# EasyEDA Pro project ACDC_双向.eprj, board 全桥（TO-277）
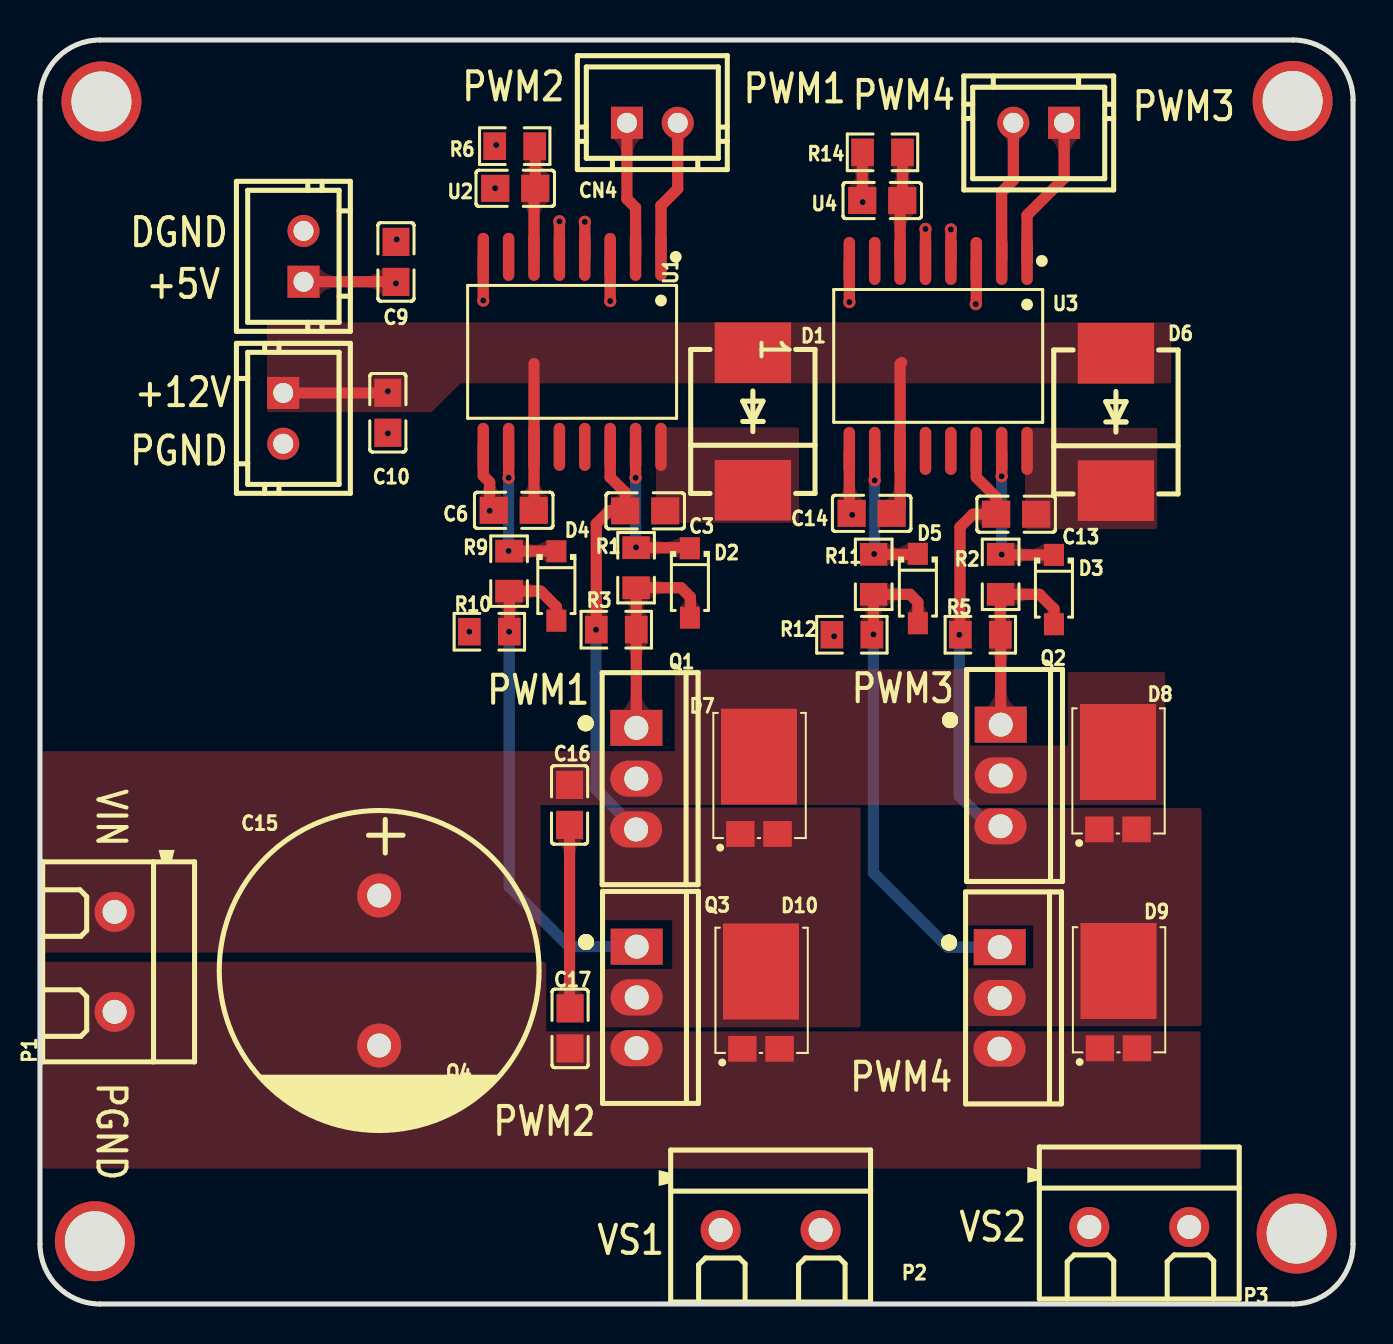
[diagram p9: board, top side]
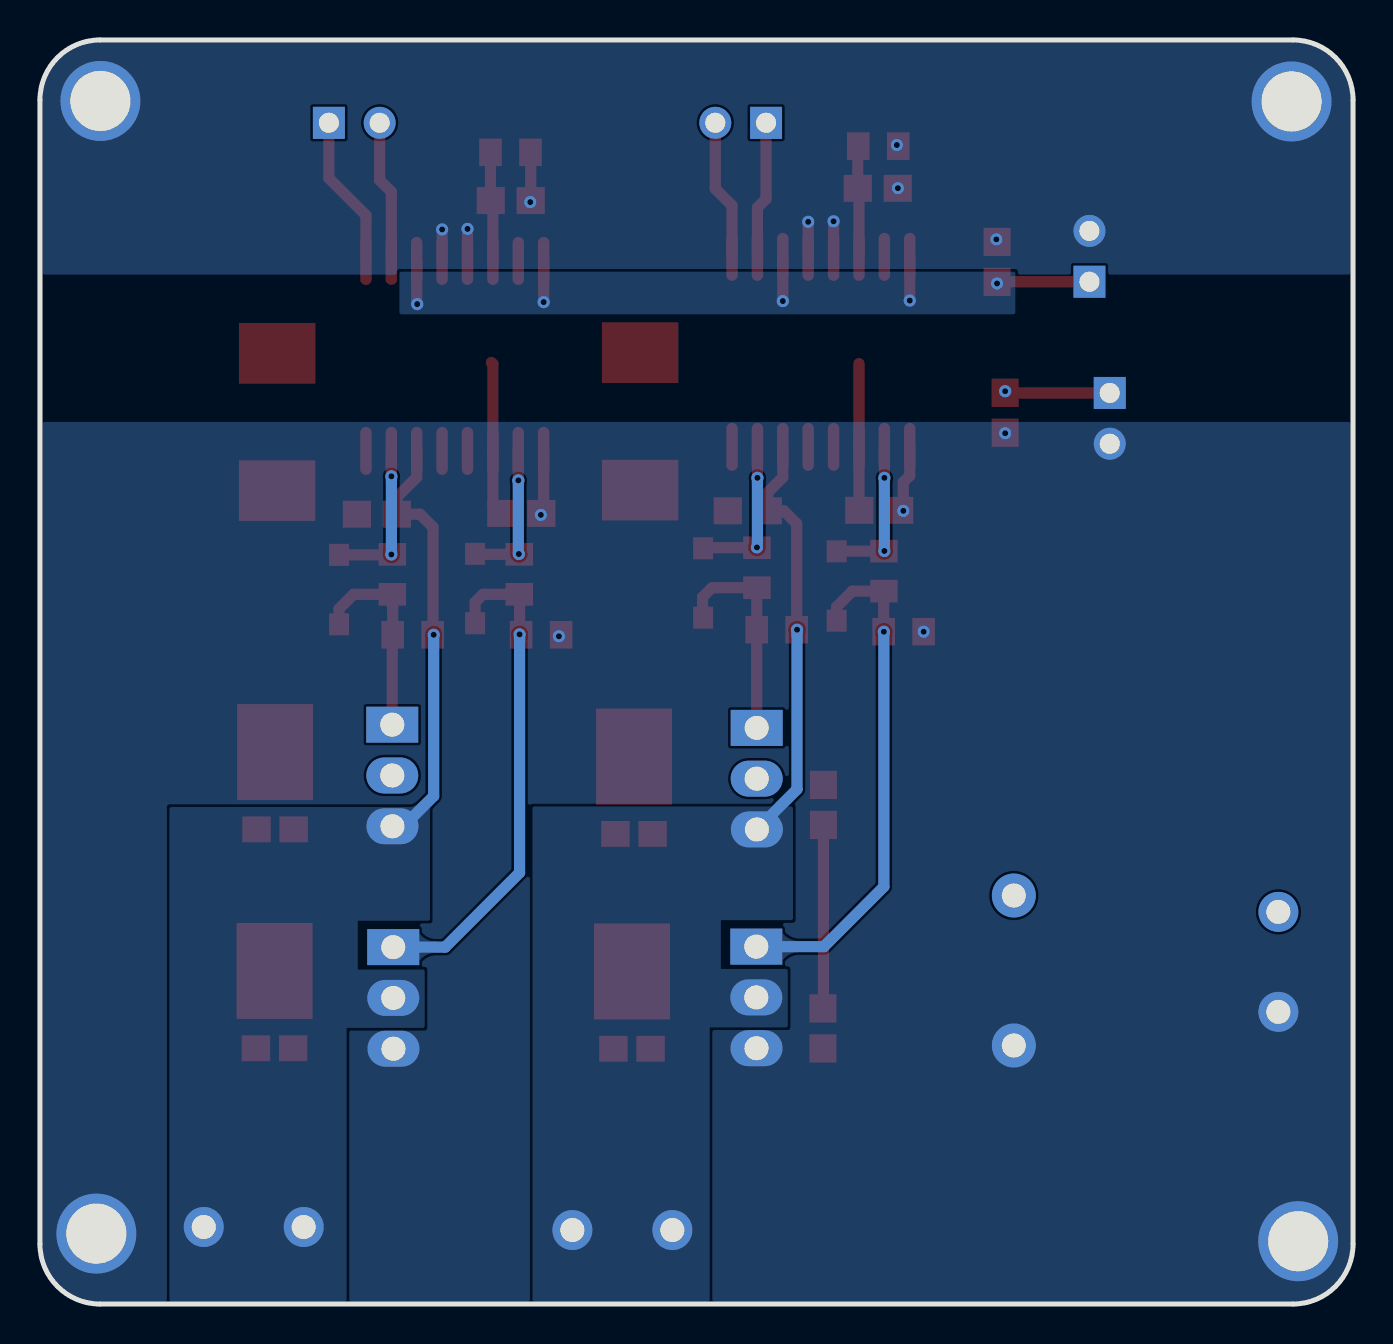
[diagram p10: board, bottom side, seen from below]

Outline 65.68 x 63.21 mm; copper layers: Top Layer, Bottom Layer. Coordinates in mm from the lower left corner of the outline.
Outline path: 0,60.21 0,3 arc(0.88,0.88) 3,0 62.68,0 arc(64.81,0.88) 65.68,3 65.68,60.21 arc(64.81,62.33) 62.68,63.21 3,63.21 arc(0.88,62.33) 0,60.21
Stack: Top Layer 0.035mm / Dielectric1 1.51mm FR4 er 4.5 / Bottom Layer 0.035mm

## Design rules (mm)
template: 自定义配置
spacing copperThickness1oz (default): track to track 0.102, other pairs 0.152 to 0.3
spacing copperThickness2oz: track to track 0.203, other pairs 0.152 to 0.3
track width copperThickness1oz (default): min 0.127, default 0.254, max 25.4
track width copperThickness2oz: min 0.203, default 0.254, max 2.54
differential pair differentialPair (default): width min 0.127, default 0.254, max 2.54; gap min 0.152, default 0.152
via viaSize (default): diameter min 0.5, default 0.61, max 10; hole min 0.3, default 0.305, max 6.299

## Placement (name value [footprint] x y rotation side)
C3  1uF  [C0805]  30.28 39.66 0 top
C6  1uF  [C0805]  23.7 39.69 0 top
C9  100nF  [C0805]  17.81 52.11 270 top
C10  100nF  [C0805]  17.4 44.57 90 top
C13  1uF  [C0805]  48.83 39.5 0 top
C14  1uF  [C0805]  41.61 39.54 0 top
C15  470uF  [CAP-TH_BD16.0-P7.50-D1.2-FD]  16.97 16.68 270 top
C16  100nF  [C0805]  26.49 24.96 90 top
C17  100nF  [C0805]  26.52 13.78 90 top
CN1  CON2-2.54*2P  [CONN-TH_2P-P2.54-V]  13.18 52.39 90 top
CN2  CON2-2.54*2P  [CONN-TH_2P-P2.54-V]  49.96 59.07 180 top
CN3  CON2-2.54*2P  [CONN-TH_2P-P2.54-V]  12.17 44.29 270 top
CN4  CON2-2.54*2P  [CONN-TH_2P-P2.54-V]  30.63 59.07 0 top
D1  RS3MC  [SMC_L7.1-W6.2-LS8.1-R-RD]  35.66 44.14 90 top
D2  1N4148W  [SOD-123F_L2.7-W1.6-LS3.8-RD]  32.51 36.06 270 top
D3  1N4148W  [SOD-123F_L2.7-W1.6-LS3.8-RD]  50.72 35.73 270 top
D4  1N4148W  [SOD-123F_L2.7-W1.6-LS3.8-RD]  25.83 35.91 270 top
D5  1N4148W  [SOD-123F_L2.7-W1.6-LS3.8-RD]  43.92 35.78 270 top
D6  RS3MC  [SMC_L7.1-W6.2-LS8.1-R-RD]  53.82 44.11 90 top
D7  ST20100L  [TO-277_3P-L5.7-W4.2-LS6.5-BR]  35.97 25.44 270 top
D8  ST20100L  [TO-277_3P-L5.7-W4.2-LS6.5-BR]  53.92 25.67 270 top
D9  ST20100L  [TO-277_3P-L5.7-W4.2-LS6.5-BR]  53.95 14.72 270 top
D10  ST20100L  [TO-277_3P-L5.7-W4.2-LS6.5-BR]  36.07 14.7 270 top
NOREF  -  [Pad_e245]  3.07 60.14 0 top
NOREF#2  -  [Pad_e243]  62.66 60.16 0 top
NOREF#3  -  [Pad_e247]  62.87 3.52 0 top
NOREF#4  -  [Pad_e246]  2.74 3.14 0 top
P1  KF301-2P接线端子  [CONN-TH_XY301V-A-5.0-2P]  3.73 17.11 90 top
P2  KF301-2P接线端子  [CONN-TH_XY301V-A-5.0-2P]  36.55 3.7 180 top
P3  KF301-2P接线端子  [CONN-TH_XY301V-A-5.0-2P]  54.99 3.85 180 top
Q1  CSD19536KCS  [TO-220-3_L10.0-W4.5-P2.54-L]  29.83 26.27 270 top
Q2  CSD19536KCS  [TO-220-3_L10.0-W4.5-P2.54-L]  48.06 26.43 270 top
Q3  CSD19536KCS  [TO-220-3_L10.0-W4.5-P2.54-L]  29.84 15.33 270 top
Q4  CSD19536KCS  [TO-220-3_L10.0-W4.5-P2.54-L]  48.01 15.31 270 top
R1  2Ω  [R0805]  29.82 36.82 270 top
R2  2Ω  [R0805]  48.06 36.49 270 top
R3  10kΩ  [R0805]  28.83 33.72 0 top
R5  10kΩ  [R0805]  47.04 33.47 0 top
R6  20kΩ  [R0805]  23.75 57.9 0 top
R9  2Ω  [R0805]  23.47 36.65 270 top
R10  10kΩ  [R0805]  22.48 33.62 0 top
R11  2Ω  [R0805]  41.71 36.49 270 top
R12  10kΩ  [R0805]  40.61 33.47 0 top
R14  20kΩ  [R0805]  42.15 57.59 0 top
U1  UCC21520  [SOIC-16_L10.3-W7.5-P1.27-LS10.3-BL]  26.62 47.61 180 top
U2  100nF  [C0805]  23.77 55.79 0 top
U3  UCC21520  [SOIC-16_L10.3-W7.5-P1.27-LS10.3-BL]  44.93 47.41 180 top
U4  100nF  [C0805]  42.14 55.18 0 top

## Footprints (pads in the part's own frame, mm; a bottom-side part is the same pattern mirrored in y, then rotated)
C0805
  rect 1.41x1.35 smd: 1(-1,0) 2(1,0)
CAP-TH_BD16.0-P7.50-D1.2-FD
  round 2.2 hole 1.2: 1(-3.75,0) 2(3.75,0)
CONN-TH_2P-P2.54-V
  rect 1.6x1.6 hole 1: 1(-1.27,0)
  round 1.6 hole 1: 2(1.27,0)
CONN-TH_XY301V-A-5.0-2P
  round 2 hole 1.2: 1(-2.5,0) 2(2.5,0)
Pad_e243
  round 4 hole 3: 1(0,0)
Pad_e245
  round 4 hole 3: 1(0,0)
Pad_e246
  round 4 hole 3: 1(0,0)
Pad_e247
  round 4 hole 3: 1(0,0)
R0805
  rect 1.133x1.377 smd: 1(-1,0) 2(1,0)
SMC_L7.1-W6.2-LS8.1-R-RD
  rect 3.03x3.82 smd: 1(3.435,0) 2(-3.435,0)
SOD-123F_L2.7-W1.6-LS3.8-RD
  rect 1.1x1 smd: 1(-1.735,0) 2(1.735,0)
SOIC-16_L10.3-W7.5-P1.27-LS10.3-BL
  oval 0.574x2.401 smd: 1(-4.445,-4.75) 2(-3.175,-4.75) 3(-1.905,-4.75) 4(-0.635,-4.75) 5(0.635,-4.75) 6(1.905,-4.75) 7(3.175,-4.75) 8(4.445,-4.75) 9(4.445,4.75) 10(3.175,4.75) 11(1.905,4.75) 12(0.635,4.75) 13(-0.635,4.75) 14(-1.905,4.75) 15(-3.175,4.75) 16(-4.445,4.75)
TO-220-3_L10.0-W4.5-P2.54-L
  rect 1.8x2.6 hole 1.2: 1(-2.54,0.005)
  oval 1.8x2.6 hole 1.2: 2(0,0.005) 3(2.54,-0.005)
TO-277_3P-L5.7-W4.2-LS6.5-BR
  rect 1.29x1.423 smd: 1(1.933,-0.93) 3(1.933,0.93)
  rect 4.8x3.8 smd: 2(-1.933,0)

## Nets
As in the schematic, except:
DGND: C9.1 CN1.2 NOREF.1 NOREF#2.1 R6.1 R14.1 U1.4 U1.5 U2.1 U3.4 U3.5 U4.1
PGND: C6.1 C10.1 C14.1 C15.2 C17.1 CN3.2 D9.1 D9.3 D10.1 D10.3 NOREF#3.1 NOREF#4.1 P1.1 Q3.3 Q4.3 R10.1 R12.1 U1.9 U3.9

Pads without a net: U1 7 12 13; U3 7 12 13

## Via types
v1: diameter 0.61, hole 0.305, Top Layer to Bottom Layer, 31 vias

## Routing (per net, layer and track width the routed paths; a pad name or vN(x,y) marks a point on that pad's centre or on a via; arc(x,y) is an arc through that point)
+5V: length 13.3
  Top Layer w0.559: U1.8 v1(22.17,50.18) ; v1(46.81,50) 46.84,50.03 U3.3 ; U1.3 v1(28.52,50.15) ; CN1.1 17.8,51.12 C9.2 ; U3.8 v1(40.49,50.1)
  vias: v1(17.81,51.04)
+12V: length 20.4
  Top Layer w0.559: C6.2 24.71,39.71 24.71,47.03 ; C14.2 43.03,39.96 U3.11 43.03,47.01 43.1,47.08 ; CN3.1 17.31,45.56 v1(17.4,45.65)
DGND: length 9.2
  Top Layer w0.559: U3.5 v1(44.3,53.76) ; v1(41.16,55.1) 41.14,55.13 ; 41.14,55.13 U4.1 41.14,57.58 R14.1 ; U1.5 v1(25.98,54.14) ; U3.4 v1(45.57,53.74) ; U1.4 v1(27.25,54.12)
  vias: v1(17.84,53.24) v1(22.82,57.96) v1(22.77,55.8)
PGND: length 6.7
  Top Layer w0.559: U3.9 40.49,39.66 C14.1 ; v1(39.73,33.39) 39.69,33.39 R12.1 ; 22.17,42.86 22.17,41.42 22.5,41.1 v1(22.5,39.66) ; C10.1 v1(17.4,43.54)
  vias: v1(21.48,33.62) v1(40.63,39.46)
H1: length 7.7
  Top Layer w0.559: R1.1 32.49,37.82 D2.1 ; 29.79,42.86 v1(29.79,41.32)
  Bottom Layer w0.559: v1(29.79,41.32) 29.79,37.86 v1(29.82,37.84)
H2: length 7.9
  Top Layer w0.559: D3.1 48.12,37.46 v1(48.11,37.48) 48.07,37.48 R2.1 ; U3.15 48.11,41.4 v1(48.1,41.39)
  Bottom Layer w0.559: v1(48.11,37.48) 48.1,37.48 v1(48.1,41.39)
L1: length 7.6
  Top Layer w0.559: 25.83,37.64 25.82,37.65 R9.1 ; 23.44,42.86 v1(23.44,41.32)
  Bottom Layer w0.559: v1(23.44,41.32) v1(23.44,37.66)
L2: length 7.4
  Top Layer w0.559: v1(41.75,41.19) 41.76,41.19 U3.10 ; D5.1 43.89,37.49 R11.1
  Bottom Layer w0.559: v1(41.73,37.51) 41.75,37.53 v1(41.75,41.19)
PWM1: length 7.1
  Top Layer w0.559: U1.1 31.06,54.93 31.9,55.77 CN4.2
PWM2: length 6.9
  Top Layer w0.559: U1.2 29.79,54.83 29.36,55.26 CN4.1
PWM3: length 7.7
  Top Layer w0.559: CN2.1 51.23,56.3 49.38,54.45 U3.1
PWM4: length 7.1
  Top Layer w0.559: CN2.2 48.69,56.2 48.11,55.62 U3.2
VS1: length 21.3
  Top Layer w0.559: R3.1 27.83,39.02 28.47,39.66 C3.1 29.28,40.59 28.52,41.34 28.52,42.86
  Bottom Layer w0.559: v1(27.81,33.72) 27.81,25.74 Q1.3
VS2: length 21.9
  Top Layer w0.559: U3.14 46.84,41.34 47.83,40.35 C13.1 46.67,39.5 46.02,38.85 46.02,33.5 v1(45.99,33.47) R5.1
  Bottom Layer w0.559: Q2.3 47.5,23.89 45.99,25.4 v1(45.99,33.47)
$1N1981: length 25.8
  Top Layer w0.559: D4.2 25.83,34.86 25.05,35.65 R9.2 23.48,35.64 R10.2
  Bottom Layer w0.559: Q3.1 26.47,17.87 23.47,20.87 v1(23.47,33.62)
$1N1983: length 11
  Top Layer w0.559: 32.51,34.32 32.54,34.35 32.54,35.35 32.06,35.82 R1.2 29.83,35.81 R3.2 29.83,33.72 Q1.1
$1N1985: length 10.3
  Top Layer w0.559: D3.2 50.72,34.76 50,35.49 R2.2 48.06,34.89 48.04,34.87 R5.2 48.06,33.45 Q2.1
$1N1987: length 25.2
  Top Layer w0.559: D5.2 43.92,35.09 43.52,35.49 R11.2 41.69,35.48 v1(41.69,33.49)
  Bottom Layer w0.559: v1(41.69,33.49) 41.69,21.57 45.41,17.85 Q4.1
$1N1994: length 5.5
  Top Layer w0.559: U3.6 43.03,55.08 U4.2 43.15,55.2 R14.2
$1N2002: length 5.6
  Top Layer w0.559: U1.6 24.71,55.73 U2.2 24.77,57.88 R6.2
$1N8248: length 9.2
  Top Layer w0.559: C16.1 26.49,14.81 C17.2

## Copper pours and planes (outline as drawn; the poured copper is in the pictures)
+5V on Bottom Layer: 16.89,51.63 47.7,51.63 47.7,49.49 16.89,49.49
+12V on Top Layer: 11.35,44.59 19.58,44.59 21.03,46.04 56.59,46.04 56.59,49.1 11.35,49.1
+VIN on Top Layer: -0.13,17.57 25.04,17.57 25.04,24.96 56.29,24.96 56.29,31.61 51.41,31.61 51.41,27.93 46.53,27.93 46.53,31.73 31.75,31.73 31.75,27.64 -0.13,27.64
DGND on Bottom Layer: -0.23,63.49 65.68,63.49 65.68,51.48 -0.23,51.48
PGND on Top Layer: 0.13,17.11 25.32,17.11 25.32,13.63 58.06,13.63 58.06,6.77 0.13,6.77
PGND on Bottom Layer: -0.7,44.11 65.89,44.11 65.89,-0.39 -0.7,-0.39
VS1 on Top Layer: 28.02,24.88 41.05,24.88 41.05,13.83 28.28,13.83 28.28,16.75 31.62,16.75 31.62,19.19 28.02,19.19
VS1 on Bottom Layer: 32.18,0 32.18,13.83 28.28,13.83 28.28,16.75 31.62,16.75 31.62,19.19 28.02,19.19 28.02,24.88 41.05,24.88 41.05,0
VS2 on Top Layer: 46.3,13.89 58.12,13.89 58.12,24.81 46.35,24.81 46.35,18.94 49.68,18.94 49.68,16.78 46.3,16.78
VS2 on Bottom Layer: 50.34,-0.03 50.34,13.81 46.44,13.81 46.44,16.73 49.78,16.73 49.78,19.17 46.18,19.17 46.18,24.86 59.21,24.86 59.21,-0.03
$1N2012 on Top Layer: 56.17,44.1 48.99,44.1 48.99,38.46 56.17,38.46
$1N2013 on Top Layer: 38.25,44.12 30.54,44.12 30.54,38.78 38.25,38.78

Small or netless copper shapes (teardrops, artwork), in the pictures only: 107 on Top Layer, 16 on Bottom Layer

## Text on the board
Top Silkscreen Layer: PWM2 | PWM1 | VS1 | PWM4 | PWM3 | VS2 | PGND | 1 | DGND | +12V | +5V | VIN
